# Altium schematic sheet Power.SchDoc: {Наименование}
size 420 x 297 mm; ApprovedBy: {Утвердил}; CheckedBy: {Проверил}; DrawnBy: {Разраб.}; DocumentNumber: АБВГ 123456.789 00; SheetNumber: {}; SheetTotal: {}; Scale: {Мш.}; PageSetup: Record=PageOptions|CenterHorizontal=False|CenterVertical=False|PrintScale=0.95|XCorrection=0.00|YCorrection=0.00|PrintKind=1|BorderSize=5000000|LeftOffset=0|BottomOffset=0|Orientation=1|PaperLength=1000|PaperWidth=1000|Scale=100|PaperSource=15|PrintQuality=600|MediaType=1|DitherType=10|PaperKind=A4|PrintScaleMode=1; ProcessInspection: {Т.контр.}; Mass: {М.}; NormInspection: {Н.контр.}; Letter1Column: {}; Letter2Column: {}; Letter3Column: {}; DocumentType: {Документ}; Rule: PcbType=ProtelPcb
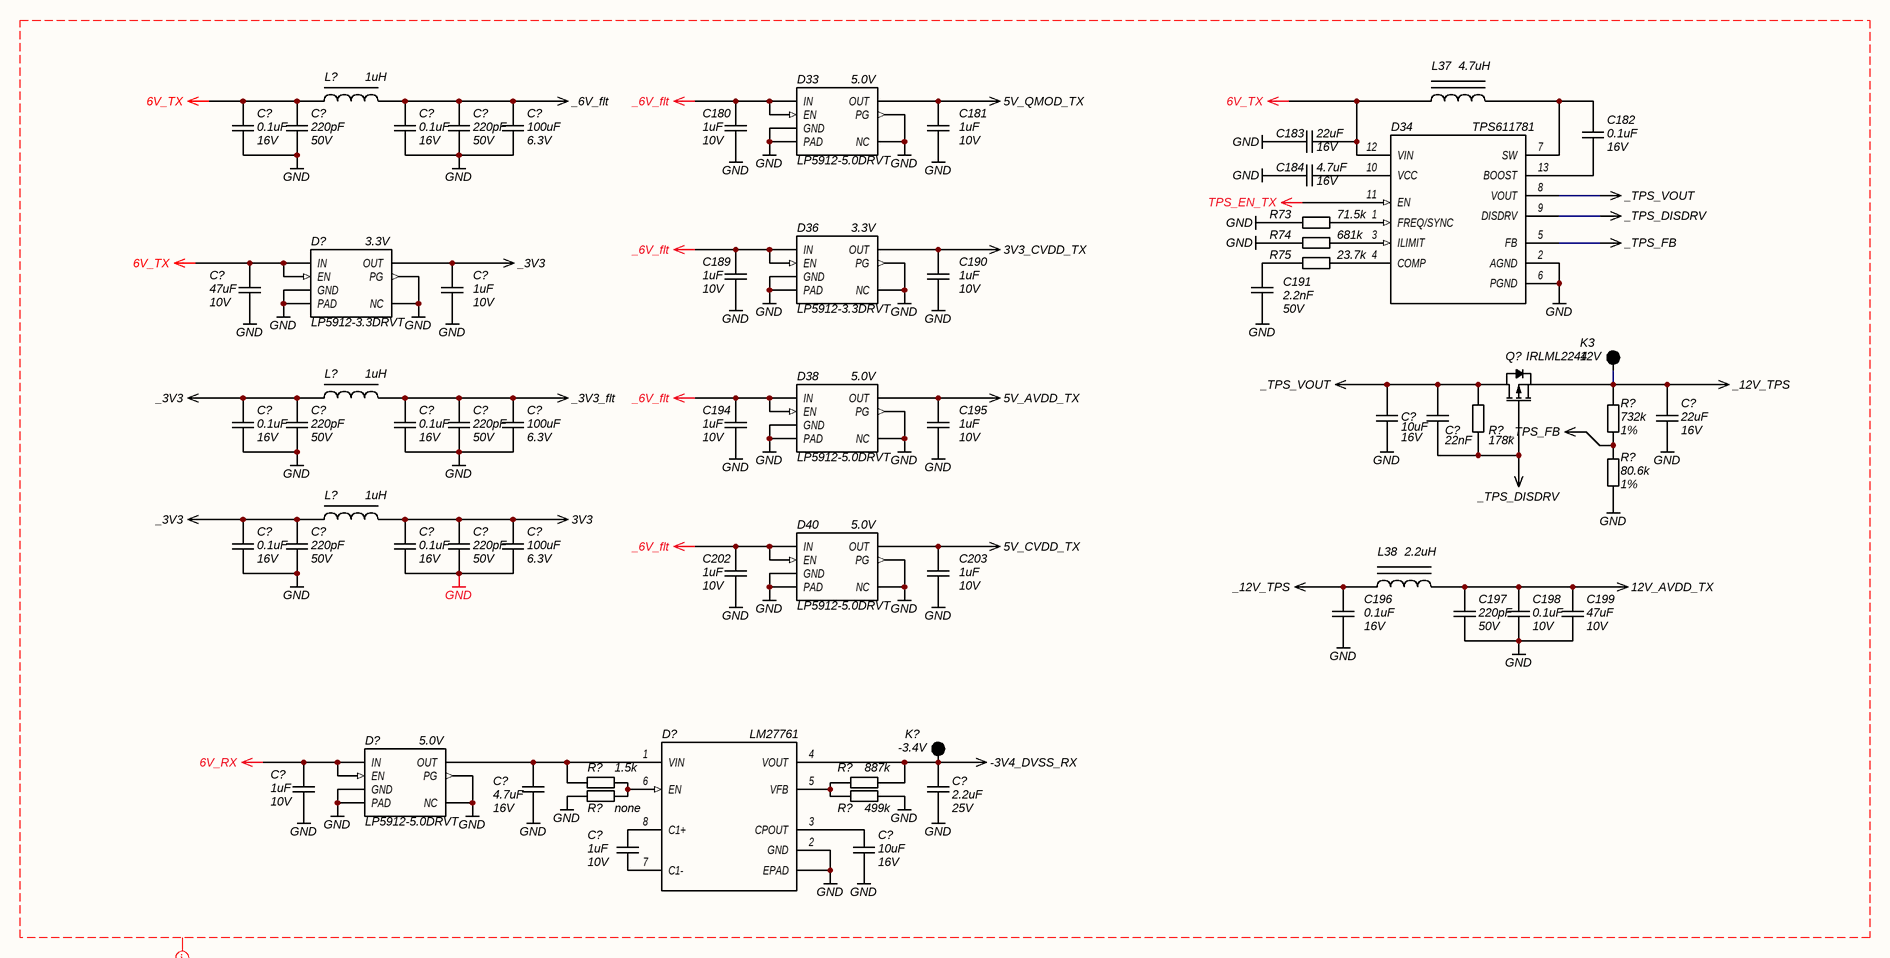
[diagram p0: Power.SchDoc]

## Parts
(Parts that share a designator on the sheet are numbered #1, #2 ... from top to bottom, then left to right.)
C180  value 1uF  Voltage: 10V  [C0805]  (hidden comment: CAP)
C181  value 1uF  Voltage: 10V  [C0805]  (hidden comment: CAP)
C182  value 0.1uF  Voltage: 16V  [C0402]  (hidden comment: CAP)
C183  value 22uF  Voltage: 16V  [C0805]  (hidden comment: CAP uF)
C184  value 4.7uF  Voltage: 16V  [C0603]  (hidden comment: CAP)
C189  value 1uF  Voltage: 10V  [C0805]  (hidden comment: CAP)
C190  value 1uF  Voltage: 10V  [C0805]  (hidden comment: CAP)
C191  value 2.2nF  Voltage: 50V  [C0603]  (hidden comment: CAP)
C194  value 1uF  Voltage: 10V  [C0805]  (hidden comment: CAP)
C195  value 1uF  Voltage: 10V  [C0805]  (hidden comment: CAP)
C196  value 0.1uF  Voltage: 16V  [C0402]  (hidden comment: CAP)
C197  value 220pF  Voltage: 50V  [C0603]  (hidden comment: CAP)
C198  value 0.1uF  Voltage: 10V  [C0402]  (hidden comment: CAP)
C199  value 47uF  Voltage: 10V  [C1210]  (hidden comment: CAP uF)
C202  value 1uF  Voltage: 10V  [C0805]  (hidden comment: CAP)
C203  value 1uF  Voltage: 10V  [C0805]  (hidden comment: CAP)
C?#1  value 0.1uF  Voltage: 16V  [C0402]  (hidden comment: CAP)
C?#2  value 220pF  Voltage: 50V  [C0603]  (hidden comment: CAP)
C?#3  value 0.1uF  Voltage: 16V  [C0402]  (hidden comment: CAP)
C?#4  value 220pF  Voltage: 50V  [C0603]  (hidden comment: CAP)
C?#5  value 100uF  Voltage: 6.3V  [C1210]  (hidden comment: CAP uF)
C?#6  value 47uF  Voltage: 10V  [C1210]  (hidden comment: CAP uF)
C?#7  value 1uF  Voltage: 10V  [C0805]  (hidden comment: CAP)
C?#8  value 10uF  Voltage: 16V  [C0805]  (hidden comment: CAP uF)
C?#9  value 22nF  [C0402]  (hidden comment: CAP)
C?#10  value 22uF  Voltage: 16V  [C0805]  (hidden comment: CAP uF)
C?#11  value 0.1uF  Voltage: 16V  [C0402]  (hidden comment: CAP)
C?#12  value 220pF  Voltage: 50V  [C0603]  (hidden comment: CAP)
C?#13  value 0.1uF  Voltage: 16V  [C0402]  (hidden comment: CAP)
C?#14  value 220pF  Voltage: 50V  [C0603]  (hidden comment: CAP)
C?#15  value 100uF  Voltage: 6.3V  [C1210]  (hidden comment: CAP uF)
C?#16  value 0.1uF  Voltage: 16V  [C0402]  (hidden comment: CAP)
C?#17  value 220pF  Voltage: 50V  [C0603]  (hidden comment: CAP)
C?#18  value 0.1uF  Voltage: 16V  [C0402]  (hidden comment: CAP)
C?#19  value 220pF  Voltage: 50V  [C0603]  (hidden comment: CAP)
C?#20  value 100uF  Voltage: 6.3V  [C1210]  (hidden comment: CAP uF)
C?#21  value 1uF  Voltage: 10V  [C0805]  (hidden comment: CAP)
C?#22  value 4.7uF  Voltage: 16V  [C0603]  (hidden comment: CAP)
C?#23  value 2.2uF  Voltage: 25V  [C0603]  (hidden comment: CAP)
C?#24  value 1uF  Voltage: 10V  [C0805]  (hidden comment: CAP)
C?#25  value 10uF  Voltage: 16V  [C0805]  (hidden comment: CAP uF)
D33  Name: LP5912-5.0DRVT  Voltage: 5.0V  [WSON-6]  (hidden comment: LP5912)
D34  TPS611781  [TPS611781x]
D36  Name: LP5912-3.3DRVT  Voltage: 3.3V  [WSON-6]  (hidden comment: LP5912)
D38  Name: LP5912-5.0DRVT  Voltage: 5.0V  [WSON-6]  (hidden comment: LP5912)
D40  Name: LP5912-5.0DRVT  Voltage: 5.0V  [WSON-6]  (hidden comment: LP5912)
D?#1  Name: LP5912-3.3DRVT  Voltage: 3.3V  [WSON-6]  (hidden comment: LP5912)
D?#2  Name: LP5912-5.0DRVT  Voltage: 5.0V  [WSON-6]  (hidden comment: LP5912)
D?#3  LM27761  [WSON-8]
K3  12V  [Control Point]
K?  -3.4V  [Control Point]
L37  value 4.7uH  [XAL4030]  (hidden comment: Inductor PWR)
L38  value 2.2uH  [XAL4020]  (hidden comment: Inductor PWR)
L?#1  value 1uH  [L1210_Murata LQH]  (hidden comment: Inductor LF)
L?#2  value 1uH  [L1210_Murata LQH]  (hidden comment: Inductor LF)
L?#3  value 1uH  [L1210_Murata LQH]  (hidden comment: Inductor LF)
Q?  IRLML2244  [SOT-23]
R73  value 71.5k  [R0402]  (hidden comment: RES)
R74  value 681k  [R0402]  (hidden comment: RES)
R75  value 23.7k  [R0603]  (hidden comment: RES)
R?#1  value 178k  [R0402]  (hidden comment: RES)
R?#2  value 732k  Tolerance: 1%  [R0402]  (hidden comment: RES)
R?#3  value 80.6k  Tolerance: 1%  [R0402]  (hidden comment: RES)
R?#4  value 1.5k  [R0402]  (hidden comment: RES)
R?#5  value 887k  [R0402]  (hidden comment: RES)
R?#6  value none  [R0603]  (hidden comment: RES)
R?#7  value 499k  [R0402]  (hidden comment: RES)

## Nets
3V3: C?#18.2 C?#19.2 C?#20.2 L?#3.2
3V3_CVDD_TX: C190.1 D36.1(OUT)
5V_AVDD_TX: C195.1 D38.1(OUT)
5V_CVDD_TX: C203.1 D40.1(OUT)
5V_QMOD_TX: C181.1 D33.1(OUT)
6V_RX: C?#21.1 D?#2.4(EN) D?#2.6(IN)
6V_TX: C183.1 C?#1.2 C?#2.2 C?#6.2 D34.12(VIN) D?#1.4(EN) D?#1.6(IN) L37.1 L?#1.1
12V_AVDD_TX: C197.2 C198.2 C199.2 L38.2
-3V4_DVSS_RX: C?#23.1 D?#3.4(VOUT) K?.1 R?#5.2
_3V3: C?#7.1 C?#11.2 C?#12.2 C?#16.2 C?#17.2 D?#1.1(OUT) L?#2.1 L?#3.1
_3V3_flt: C?#13.2 C?#14.2 C?#15.2 L?#2.2
_6V_flt: C180.1 C189.1 C194.1 C202.1 C?#3.2 C?#4.2 C?#5.2 D33.4(EN) D33.6(IN) D36.4(EN) D36.6(IN) D38.4(EN) D38.6(IN) D40.4(EN) D40.6(IN) L?#1.2
_12V_TPS: C196.2 C?#10.2 K3.1 L38.1 Q?.2(S) R?#2.2
_TPS_DISDRV: C?#9.2 D34.9(DISDRV) Q?.1(G) R?#1.1
_TPS_FB: D34.5(FB) R?#2.1 R?#3.2
_TPS_VOUT: C?#8.2 C?#9.1 D34.8(VOUT) Q?.3(D) R?#1.2
GND: C180.2 C181.2 C183.2 C184.2 C189.2 C190.2 C191.1 C194.2 C195.2 C196.1 C197.1 C198.1 C199.1 C202.2 C203.2 C?#1.1 C?#2.1 C?#3.1 C?#4.1 C?#5.1 C?#6.1 C?#7.2 C?#8.1 C?#10.1 C?#11.1 C?#12.1 C?#13.1 C?#14.1 C?#15.1 C?#16.1 C?#17.1 C?#18.1 C?#19.1 C?#20.1 C?#21.2 C?#22.2 C?#23.2 C?#25.2 D33.0(PAD) D33.2(NC) D33.3(PG) D33.5(GND) D34.2(AGND) D34.6(PGND) D36.0(PAD) D36.2(NC) D36.3(PG) D36.5(GND) D38.0(PAD) D38.2(NC) D38.3(PG) D38.5(GND) D40.0(PAD) D40.2(NC) D40.3(PG) D40.5(GND) D?#1.0(PAD) D?#1.2(NC) D?#1.3(PG) D?#1.5(GND) D?#2.0(PAD) D?#2.2(NC) D?#2.3(PG) D?#2.5(GND) D?#3.0(EPAD) D?#3.2(GND) R73.1 R74.1 R?#3.1 R?#6.1 R?#7.2
TPS_EN_TX: D34.11(EN)
NetC182_1: C182.1 D34.13(BOOST)
NetC182_2: C182.2 D34.7(SW) L37.2
NetC184_1: C184.1 D34.10(VCC)
NetC191_2: C191.2 R75.1
NetC?#22_1: C?#22.1 D?#2.1(OUT) D?#3.1(VIN) R?#4.2
NetC?#24_1: C?#24.1 D?#3.7(C1-)
NetC?#24_2: C?#24.2 D?#3.8(C1+)
NetC?#25_1: C?#25.1 D?#3.3(CPOUT)
NetD34_1: D34.1(FREQ/SYNC) R73.2
NetD34_3: D34.3(ILIMIT) R74.2
NetD34_4: D34.4(COMP) R75.2
NetD?#3_5: D?#3.5(VFB) R?#5.1 R?#7.1
NetD?#3_6: D?#3.6(EN) R?#4.1 R?#6.2

## Layout directives
net class POWER: 3V3, 3V3_CVDD_TX, 5V_AVDD_TX, 5V_CVDD_TX, 5V_QMOD_TX, 6V_RX, 6V_TX, 12V_AVDD_TX, -3V4_DVSS_RX, _3V3, _3V3_flt, _6V_flt, _12V_TPS, _TPS_DISDRV, _TPS_FB, _TPS_VOUT, GND, TPS_EN_TX

## Notes on the sheet
- Перв. примен.
- Справ. №
- Подп. и дата
- Инв. № дубл.
- Взам. инв. №
- Изм.
- Лист
- № докум.
- Подп.
- Дата
- Лит.
- Масса
- Масштаб
- Т.контр.
- Пров.
- Разраб.
- Листов
- Инв. № подл.
- Н.контр.
- Утв.
- Копировал
- Формат А3

## Library data of the parts
C180 C181 C189 C190 C194 C195 C202 C203 C?#7 C?#21 C?#24 = CAP: SMD Capacitor; Manufacturer: Murata; Material: X7R; Tolerance: 10%; Type: Ceramic Capacitor; P/N: GRM21BR71A105KA01K
C182 C196 = CAP: SMD Capacitor; Manufacturer: Murata; Material: X5R; Tolerance: ±10%; Type: Ceramic Capacitor; P/N: GRM155R61C104KA88D
C183 C?#10 = CAP uF: SMD Capacitor; Manufacturer: Murata; Material: X5R; Tolerance: ±20%; Type: Ceramic Capacitor; P/N: GRM21BR61C226ME44L
C184 C?#22 = CAP: SMD Capacitor; Manufacturer: Murata; Material: X5R; Tolerance: 10%; Type: Ceramic Capacitor; P/N: GRM188R61C475KAAJD
C191 = CAP: SMD Capacitor; Manufacturer: Murata; Material: NP0; Tolerance: ±5%; Type: Ceramic Capacitor; P/N: GRM1885C1H222JA01D
C197 C?#2 C?#4 C?#12 C?#14 C?#17 C?#19 = CAP: SMD Capacitor; Manufacturer: Murata; Material: X7R; Tolerance: 10%; Type: Ceramic Capacitor; P/N: GRM188R71H221KA01D
C198 = CAP: SMD Capacitor; Manufacturer: Murata; Material: X7R; Tolerance: 10%; Type: Ceramic Capacitor; P/N: GRM155R71A104KA01J
C199 C?#6 = CAP uF: SMD Capacitor; Manufacturer: Murata; Material: X7R; Tolerance: 10%; Type: Ceramic Capacitor; P/N: GRM32ER71A476KE15L
C?#1 C?#3 C?#11 C?#13 C?#16 C?#18 = CAP: SMD Capacitor; Manufacturer: Murata; Material: X7R; Tolerance: 10%; Type: Ceramic Capacitor; P/N: GRM155R71C104KA88J
C?#5 C?#15 C?#20 = CAP uF: SMD Capacitor; Manufacturer: Murata; Material: X5R; Tolerance: 20%; Type: Ceramic Capacitor; P/N: GRM32ER60J107ME20L
C?#8 C?#25 = CAP uF: SMD Capacitor; Manufacturer: Murata; Material: X5R; Tolerance: ±10%; Type: Ceramic Capacitor; P/N: GRM21BR61C106KE15K
C?#9 = CAP: SMD Capacitor; Manufacturer: Murata; Material: X7R; Tolerance: 10%; Voltage: 50V; Type: Ceramic Capacitor; P/N: GCM155R71H223KA55D
C?#23 = CAP: SMD Capacitor; Manufacturer: Murata; Material: X5R; Tolerance: 10%; Type: Ceramic Capacitor; P/N: GRM188R61E225KA12D
D33 D36 D38 D40 D?#1 D?#2 = LP5912: LP5912 500-mA Low-Noise, Low-IQ LDO; Manufacturer: Texas Instruments; Type: Low-Noise LDO; Current: 500mA; Package: WSON; Temperature Range: –40°C to 125°C; Supplier 1: Digi-Key; Supplier Part Number 1: 296-44153-2-ND
  D33 D38 D40 D?#2: P/N: LP5912-5.0DRVT
  D36 D?#1: P/N: LP5912-3.3DRVT
D34 = TPS611781: 10-A Fully-Integrated Synchronous Boost with Load Disconnect Control; Manufacturer: Texas Instruments; Voltage: 4.5 V to 20 V; P/N: TPS611781RNW; Current: 10 A; Name: TPS611781; Package: 13-VQFN-HR (3.5x3.0); Temperature Range: –40°C to 125°C; Type: Synchronous Boost; Supplier 1: Digi-Key; Supplier Part Number 1: 296-46568-1-ND
D?#3 = LM27761: Low-Noise, Regulated, Switched-Capacitor Voltage Inverter; Manufacturer: Texas Instruments; Voltage: 2.7 V to 5.5; P/N: LM27761DSGT; Current: 250 mA; Name: LM27761; Package: WSON; Temperature Range: –40°C to 125°C; Type: Voltage Inverter
K3 K? = Test  Point
L37 = Inductor PWR: Magnetic-Core Inductor; Manufacturer: Coilcraft; Name: XEL4030-472MEB; Current: 5A; Tolerance: ±30%; Temperature Range: -40ºC to 125ºC
L38 = Inductor PWR: Magnetic-Core Inductor; Manufacturer: Coilcraft; Name: XEL4020-222MEB; Current: 5.9A; Tolerance: ±30%; Temperature Range: -40ºC to 125ºC
L?#1-L?#3 = Inductor LF: Inductor Power Lines; Manufacturer: Murata; Name: LQH32PN1R0NNC; Current: 2500mA; Tolerance: 5%; Frequency: 100MHz; Temperature Range: -25ºC to 85ºC; Series: LQH; P/N: LQH32PN1R0NNC
Q? = IRLML2244: P-Channel MOSFET; Current: 4.3A; Channel Resistance: 54 mΩ; Power Dissipation: 1.3W; Voltage: -20V; P/N: IRLML2244TRPBF; Name: IRLML2244; Package: SOT-23; Type: P-Channel Mosfet; Value: IRLML2244
R73 = RES: SMD Resistor; Manufacturer: Panasonic Electronic Components; Name: Chip SMD Resistor; Power: 0.063 Wt; Tolerance: 1%; P/N: ERJ-2RKF7152X; Temperature Range: -55…155°C
R74 = RES: SMD Resistor; Manufacturer: Panasonic Electronic Components; Name: Chip SMD Resistor; Power: 0.063 Wt; Tolerance: 1%; P/N: ERJ-2RKF6813X; Temperature Range: -55…155°C
R75 = RES: SMD Resistor; Manufacturer: Panasonic Electronic Components; Name: Chip SMD Resistor; Power: 0.1 Wt; Tolerance: 1%; P/N: ERJ-3EKF2372V; Temperature Range: -55…155°C
R?#1 = RES: SMD Resistor; Manufacturer: Panasonic Electronic Components; Name: Chip SMD Resistor; Power: 0.063 Wt; Tolerance: 1%; P/N: ERJ-2RKF1783X; Temperature Range: -55…155°C
R?#2 = RES: SMD Resistor; Manufacturer: Panasonic Electronic Components; Name: Chip SMD Resistor; Power: 0.063 Wt; P/N: ERJ-2RKF7323X; Temperature Range: -55…155°C
R?#3 = RES: SMD Resistor; Manufacturer: Panasonic Electronic Components; Name: Chip SMD Resistor; Power: 0.063 Wt; P/N: ERJ-2RKF8062X; Temperature Range: -55…155°C
R?#4 = RES: SMD Resistor; Manufacturer: Panasonic Electronic Components; Name: Chip SMD Resistor; Power: 0.063 Wt; Tolerance: 0.5%; P/N: ERJ-2RHD1501X; Temperature Range: -55…155°C
R?#5 = RES: SMD Resistor; Manufacturer: Panasonic Electronic Components; Name: Chip SMD Resistor; Power: 0.1 Wt; Tolerance: ±1%; P/N: ERJ-2RKF8873X; Temperature Range: -55…155°C
R?#6 = RES: SMD Resistor; Name: Chip SMD Resistor; Power: 0.1 Wt; Tolerance: 1%; P/N: ERJ-2GE0R00X; Temperature Range: -55…155°C
R?#7 = RES: SMD Resistor; Manufacturer: Panasonic Electronic Components; Name: Chip SMD Resistor; Power: 0.1 Wt; Tolerance: ±1%; P/N: ERJ-2RKF4993X; Temperature Range: -55…155°C